# Altium schematic sheet Digital_Outputs.SchDoc
size A4
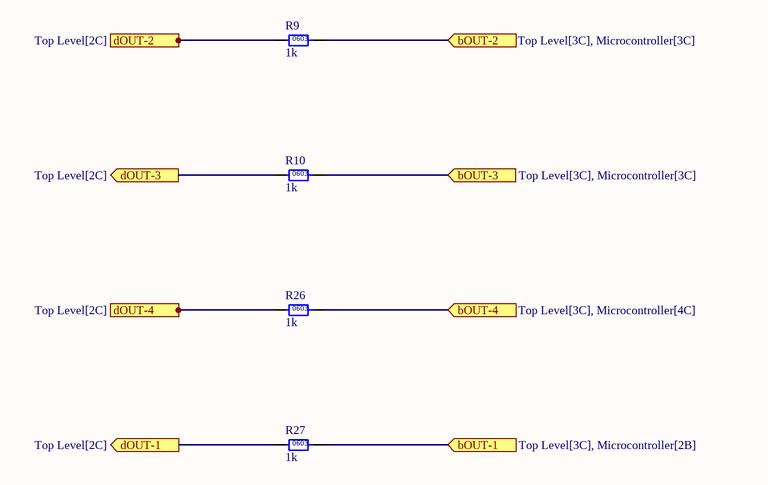
[diagram p0: Digital_Outputs.SchDoc]

## Parts
R9  1k  [0603]
R10  1k  [0603]
R26  1k  [0603]
R27  1k  [0603]

## Ports
bOUT-1 (in, see Top Level[3C], Microcontroller[2B]), bOUT-2 (in, see Top Level[3C], Microcontroller[3C]), bOUT-3 (in, see Top Level[3C], Microcontroller[3C]), bOUT-4 (in, see Top Level[3C], Microcontroller[4C]), dOUT-1 (out, see Top Level[2C]), dOUT-2 (out, see Top Level[2C]), dOUT-3 (out, see Top Level[2C]), dOUT-4 (out, see Top Level[2C])

## Nets
bOUT-1: R27.2 ; port bOUT-1
bOUT-2: R9.2 ; port bOUT-2
bOUT-3: R10.2 ; port bOUT-3
bOUT-4: R26.2 ; port bOUT-4
dOUT-1: R27.1 ; port dOUT-1
dOUT-2: R9.1 ; port dOUT-2
dOUT-3: R10.1 ; port dOUT-3
dOUT-4: R26.1 ; port dOUT-4

## Notes on the sheet
- (in symbol RC0603FR-071KL) 0603

## Library data of the parts
R9 R10 R26 R27 = RC0603FR-071KL: Manufacturer: YAGEO; Tolerance: 0.01; Rated Power: 0.1W; Part Number: RC0603FR-071KL; Value: 1k; Material: FR-07; Digikey Part Number: 311-1.00KHRCT-ND